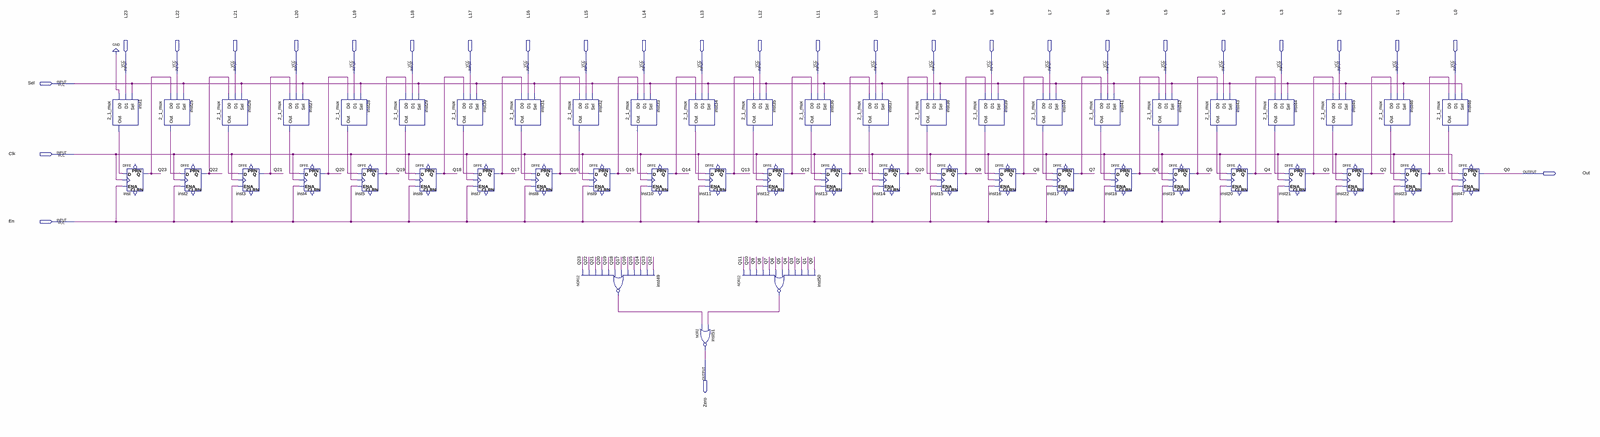
[diagram p0: schematic sheet, whole]
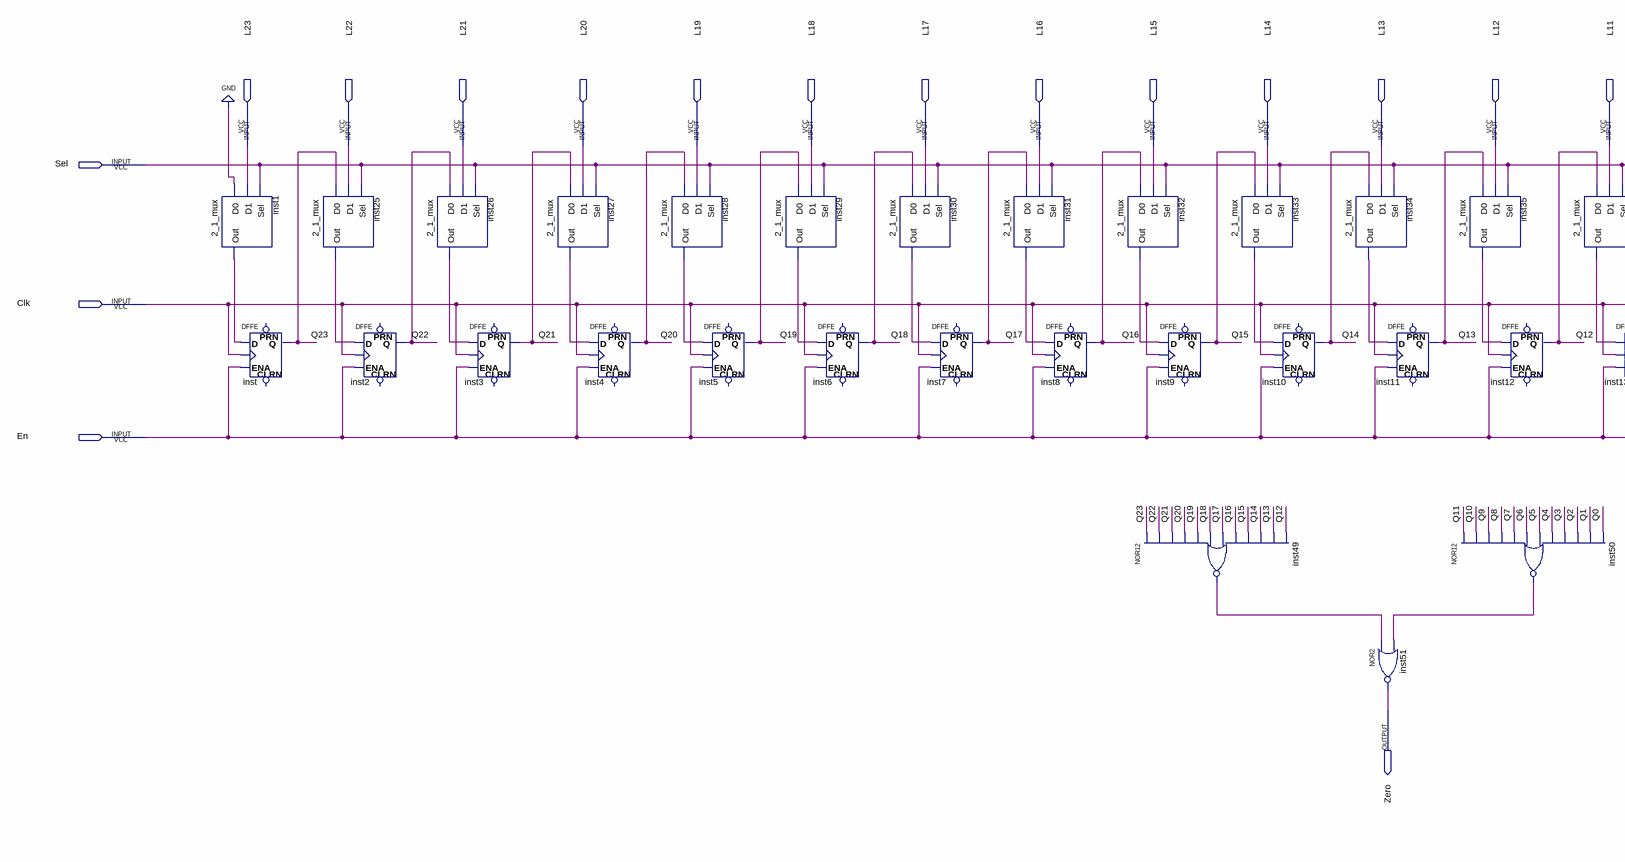
[diagram p1: schematic sheet, left part]
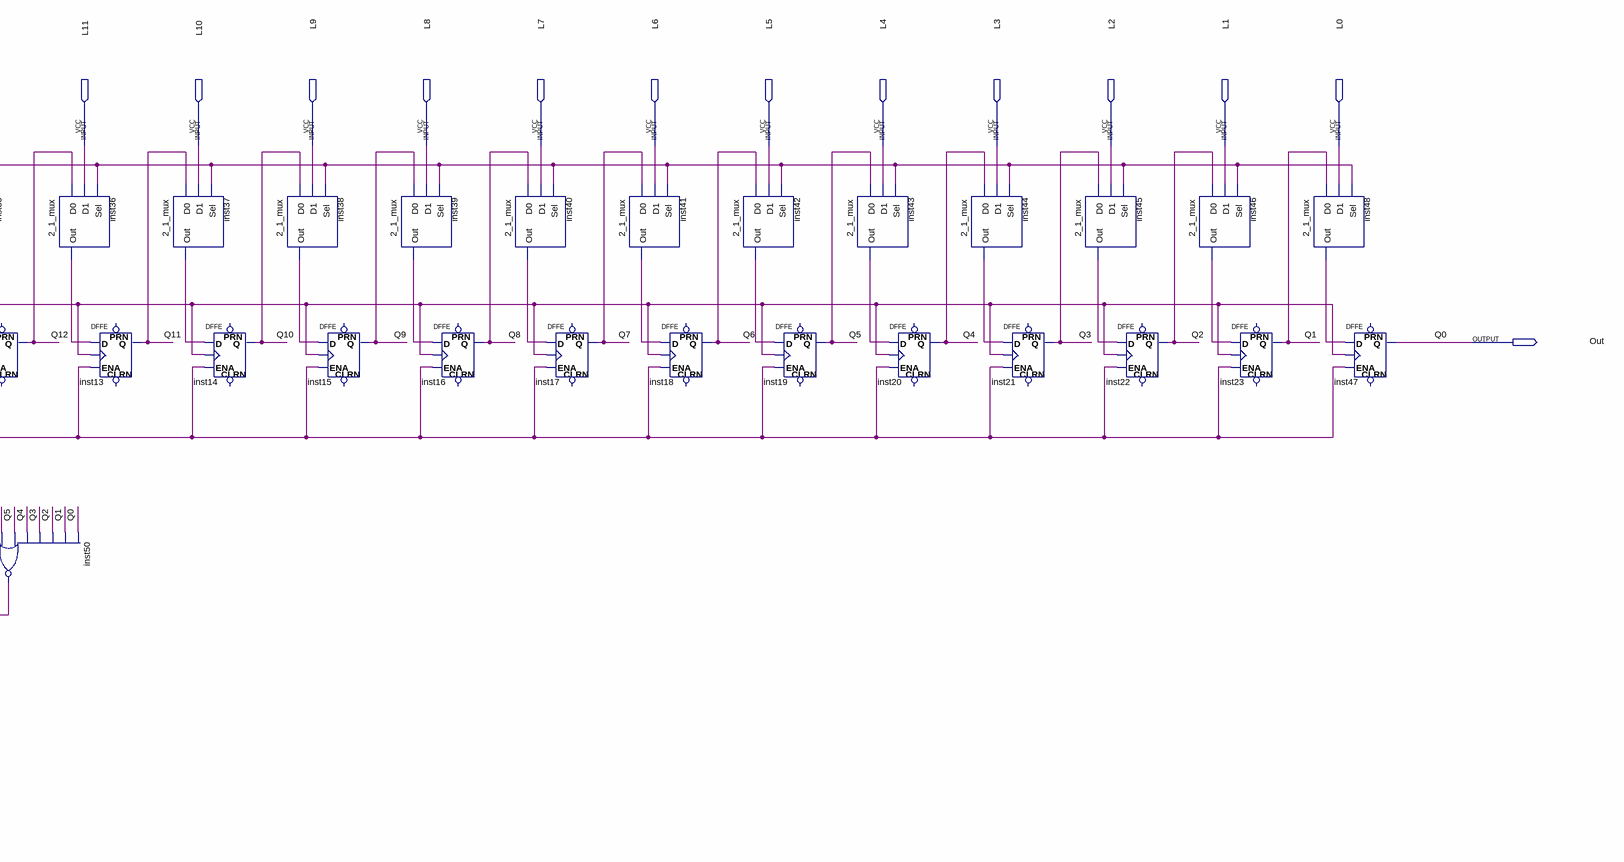
[diagram p2: schematic sheet, right part]
// Quartus schematic 24_bit_par_in_ser_out_reg.bdf as structural Verilog: 51 symbols, 29 pins
module \24_bit_par_in_ser_out_reg  (
  input  L23,
  input  L22,
  input  L21,
  input  L20,
  input  L19,
  input  L18,
  input  L17,
  input  L16,
  input  L15,
  input  L14,
  input  L13,
  input  L12,
  input  L11,
  input  L10,
  input  L9,
  input  L8,
  input  L7,
  input  L6,
  input  L5,
  input  L4,
  input  L3,
  input  L2,
  input  L1,
  input  L0,
  input  Sel,
  input  Clk,
  input  En,
  output Out,
  output Zero
);

  wire inst1_out, inst25_out, inst26_out, inst27_out, inst28_out, inst29_out, inst30_out, inst31_out,
       inst32_out, inst33_out, inst34_out, inst35_out, inst36_out, inst37_out, inst38_out, inst39_out,
       inst40_out, inst41_out, inst42_out, inst43_out, inst44_out, inst45_out, inst46_out, inst48_out,
       inst49_out, inst50_out, Q1, Q2, Q3, Q4, Q5, Q6, Q7, Q8, Q9, Q10, Q11, Q12, Q13, Q14, Q15, Q16, Q17,
       Q18, Q19, Q20, Q21, Q22, Q23;

  \2_1_mux  inst1 (.D0(1'b0), .D1(L23), .Sel(Sel), .Out(inst1_out));
  DFFE inst (.D(inst1_out), .CLK(Clk), .ENA(En), .Q(Q23));  // open: PRN, CLRN
  \2_1_mux  inst25 (.D0(Q23), .D1(L22), .Sel(Sel), .Out(inst25_out));
  DFFE inst2 (.D(inst25_out), .CLK(Clk), .ENA(En), .Q(Q22));  // open: PRN, CLRN
  \2_1_mux  inst26 (.D0(Q22), .D1(L21), .Sel(Sel), .Out(inst26_out));
  DFFE inst3 (.D(inst26_out), .CLK(Clk), .ENA(En), .Q(Q21));  // open: PRN, CLRN
  \2_1_mux  inst27 (.D0(Q21), .D1(L20), .Sel(Sel), .Out(inst27_out));
  DFFE inst4 (.D(inst27_out), .CLK(Clk), .ENA(En), .Q(Q20));  // open: PRN, CLRN
  \2_1_mux  inst28 (.D0(Q20), .D1(L19), .Sel(Sel), .Out(inst28_out));
  DFFE inst5 (.D(inst28_out), .CLK(Clk), .ENA(En), .Q(Q19));  // open: PRN, CLRN
  \2_1_mux  inst29 (.D0(Q19), .D1(L18), .Sel(Sel), .Out(inst29_out));
  DFFE inst6 (.D(inst29_out), .CLK(Clk), .ENA(En), .Q(Q18));  // open: PRN, CLRN
  \2_1_mux  inst30 (.D0(Q18), .D1(L17), .Sel(Sel), .Out(inst30_out));
  DFFE inst7 (.D(inst30_out), .CLK(Clk), .ENA(En), .Q(Q17));  // open: PRN, CLRN
  \2_1_mux  inst31 (.D0(Q17), .D1(L16), .Sel(Sel), .Out(inst31_out));
  DFFE inst8 (.D(inst31_out), .CLK(Clk), .ENA(En), .Q(Q16));  // open: PRN, CLRN
  \2_1_mux  inst32 (.D0(Q16), .D1(L15), .Sel(Sel), .Out(inst32_out));
  nor inst49 (inst49_out, Q23, Q22, Q21, Q20, Q19, Q18, Q17, Q16, Q15, Q14, Q13, Q12);
  DFFE inst9 (.D(inst32_out), .CLK(Clk), .ENA(En), .Q(Q15));  // open: PRN, CLRN
  \2_1_mux  inst33 (.D0(Q15), .D1(L14), .Sel(Sel), .Out(inst33_out));
  DFFE inst10 (.D(inst33_out), .CLK(Clk), .ENA(En), .Q(Q14));  // open: PRN, CLRN
  \2_1_mux  inst34 (.D0(Q14), .D1(L13), .Sel(Sel), .Out(inst34_out));
  DFFE inst11 (.D(inst34_out), .CLK(Clk), .ENA(En), .Q(Q13));  // open: PRN, CLRN
  nor inst51 (Zero, inst49_out, inst50_out);
  \2_1_mux  inst35 (.D0(Q13), .D1(L12), .Sel(Sel), .Out(inst35_out));
  nor inst50 (inst50_out, Q11, Q10, Q9, Q8, Q7, Q6, Q5, Q4, Q3, Q2, Q1, Out);
  DFFE inst12 (.D(inst35_out), .CLK(Clk), .ENA(En), .Q(Q12));  // open: PRN, CLRN
  \2_1_mux  inst36 (.D0(Q12), .D1(L11), .Sel(Sel), .Out(inst36_out));
  DFFE inst13 (.D(inst36_out), .CLK(Clk), .ENA(En), .Q(Q11));  // open: PRN, CLRN
  \2_1_mux  inst37 (.D0(Q11), .D1(L10), .Sel(Sel), .Out(inst37_out));
  DFFE inst14 (.D(inst37_out), .CLK(Clk), .ENA(En), .Q(Q10));  // open: PRN, CLRN
  \2_1_mux  inst38 (.D0(Q10), .D1(L9), .Sel(Sel), .Out(inst38_out));
  DFFE inst15 (.D(inst38_out), .CLK(Clk), .ENA(En), .Q(Q9));  // open: PRN, CLRN
  \2_1_mux  inst39 (.D0(Q9), .D1(L8), .Sel(Sel), .Out(inst39_out));
  DFFE inst16 (.D(inst39_out), .CLK(Clk), .ENA(En), .Q(Q8));  // open: PRN, CLRN
  \2_1_mux  inst40 (.D0(Q8), .D1(L7), .Sel(Sel), .Out(inst40_out));
  DFFE inst17 (.D(inst40_out), .CLK(Clk), .ENA(En), .Q(Q7));  // open: PRN, CLRN
  \2_1_mux  inst41 (.D0(Q7), .D1(L6), .Sel(Sel), .Out(inst41_out));
  DFFE inst18 (.D(inst41_out), .CLK(Clk), .ENA(En), .Q(Q6));  // open: PRN, CLRN
  \2_1_mux  inst42 (.D0(Q6), .D1(L5), .Sel(Sel), .Out(inst42_out));
  DFFE inst19 (.D(inst42_out), .CLK(Clk), .ENA(En), .Q(Q5));  // open: PRN, CLRN
  \2_1_mux  inst43 (.D0(Q5), .D1(L4), .Sel(Sel), .Out(inst43_out));
  DFFE inst20 (.D(inst43_out), .CLK(Clk), .ENA(En), .Q(Q4));  // open: PRN, CLRN
  \2_1_mux  inst44 (.D0(Q4), .D1(L3), .Sel(Sel), .Out(inst44_out));
  DFFE inst21 (.D(inst44_out), .CLK(Clk), .ENA(En), .Q(Q3));  // open: PRN, CLRN
  \2_1_mux  inst45 (.D0(Q3), .D1(L2), .Sel(Sel), .Out(inst45_out));
  DFFE inst22 (.D(inst45_out), .CLK(Clk), .ENA(En), .Q(Q2));  // open: PRN, CLRN
  \2_1_mux  inst46 (.D0(Q2), .D1(L1), .Sel(Sel), .Out(inst46_out));
  DFFE inst23 (.D(inst46_out), .CLK(Clk), .ENA(En), .Q(Q1));  // open: PRN, CLRN
  \2_1_mux  inst48 (.D0(Q1), .D1(L0), .Sel(Sel), .Out(inst48_out));
  DFFE inst47 (.D(inst48_out), .CLK(Clk), .ENA(En), .Q(Out));  // open: PRN, CLRN

  // Other names for the same wires on the sheet: Q0 = Out
endmodule
